# Altium schematic sheet C283x_DSP.SchDoc
size C; DocumentNumber: 3; SheetNumber: 3; SheetTotal: 9
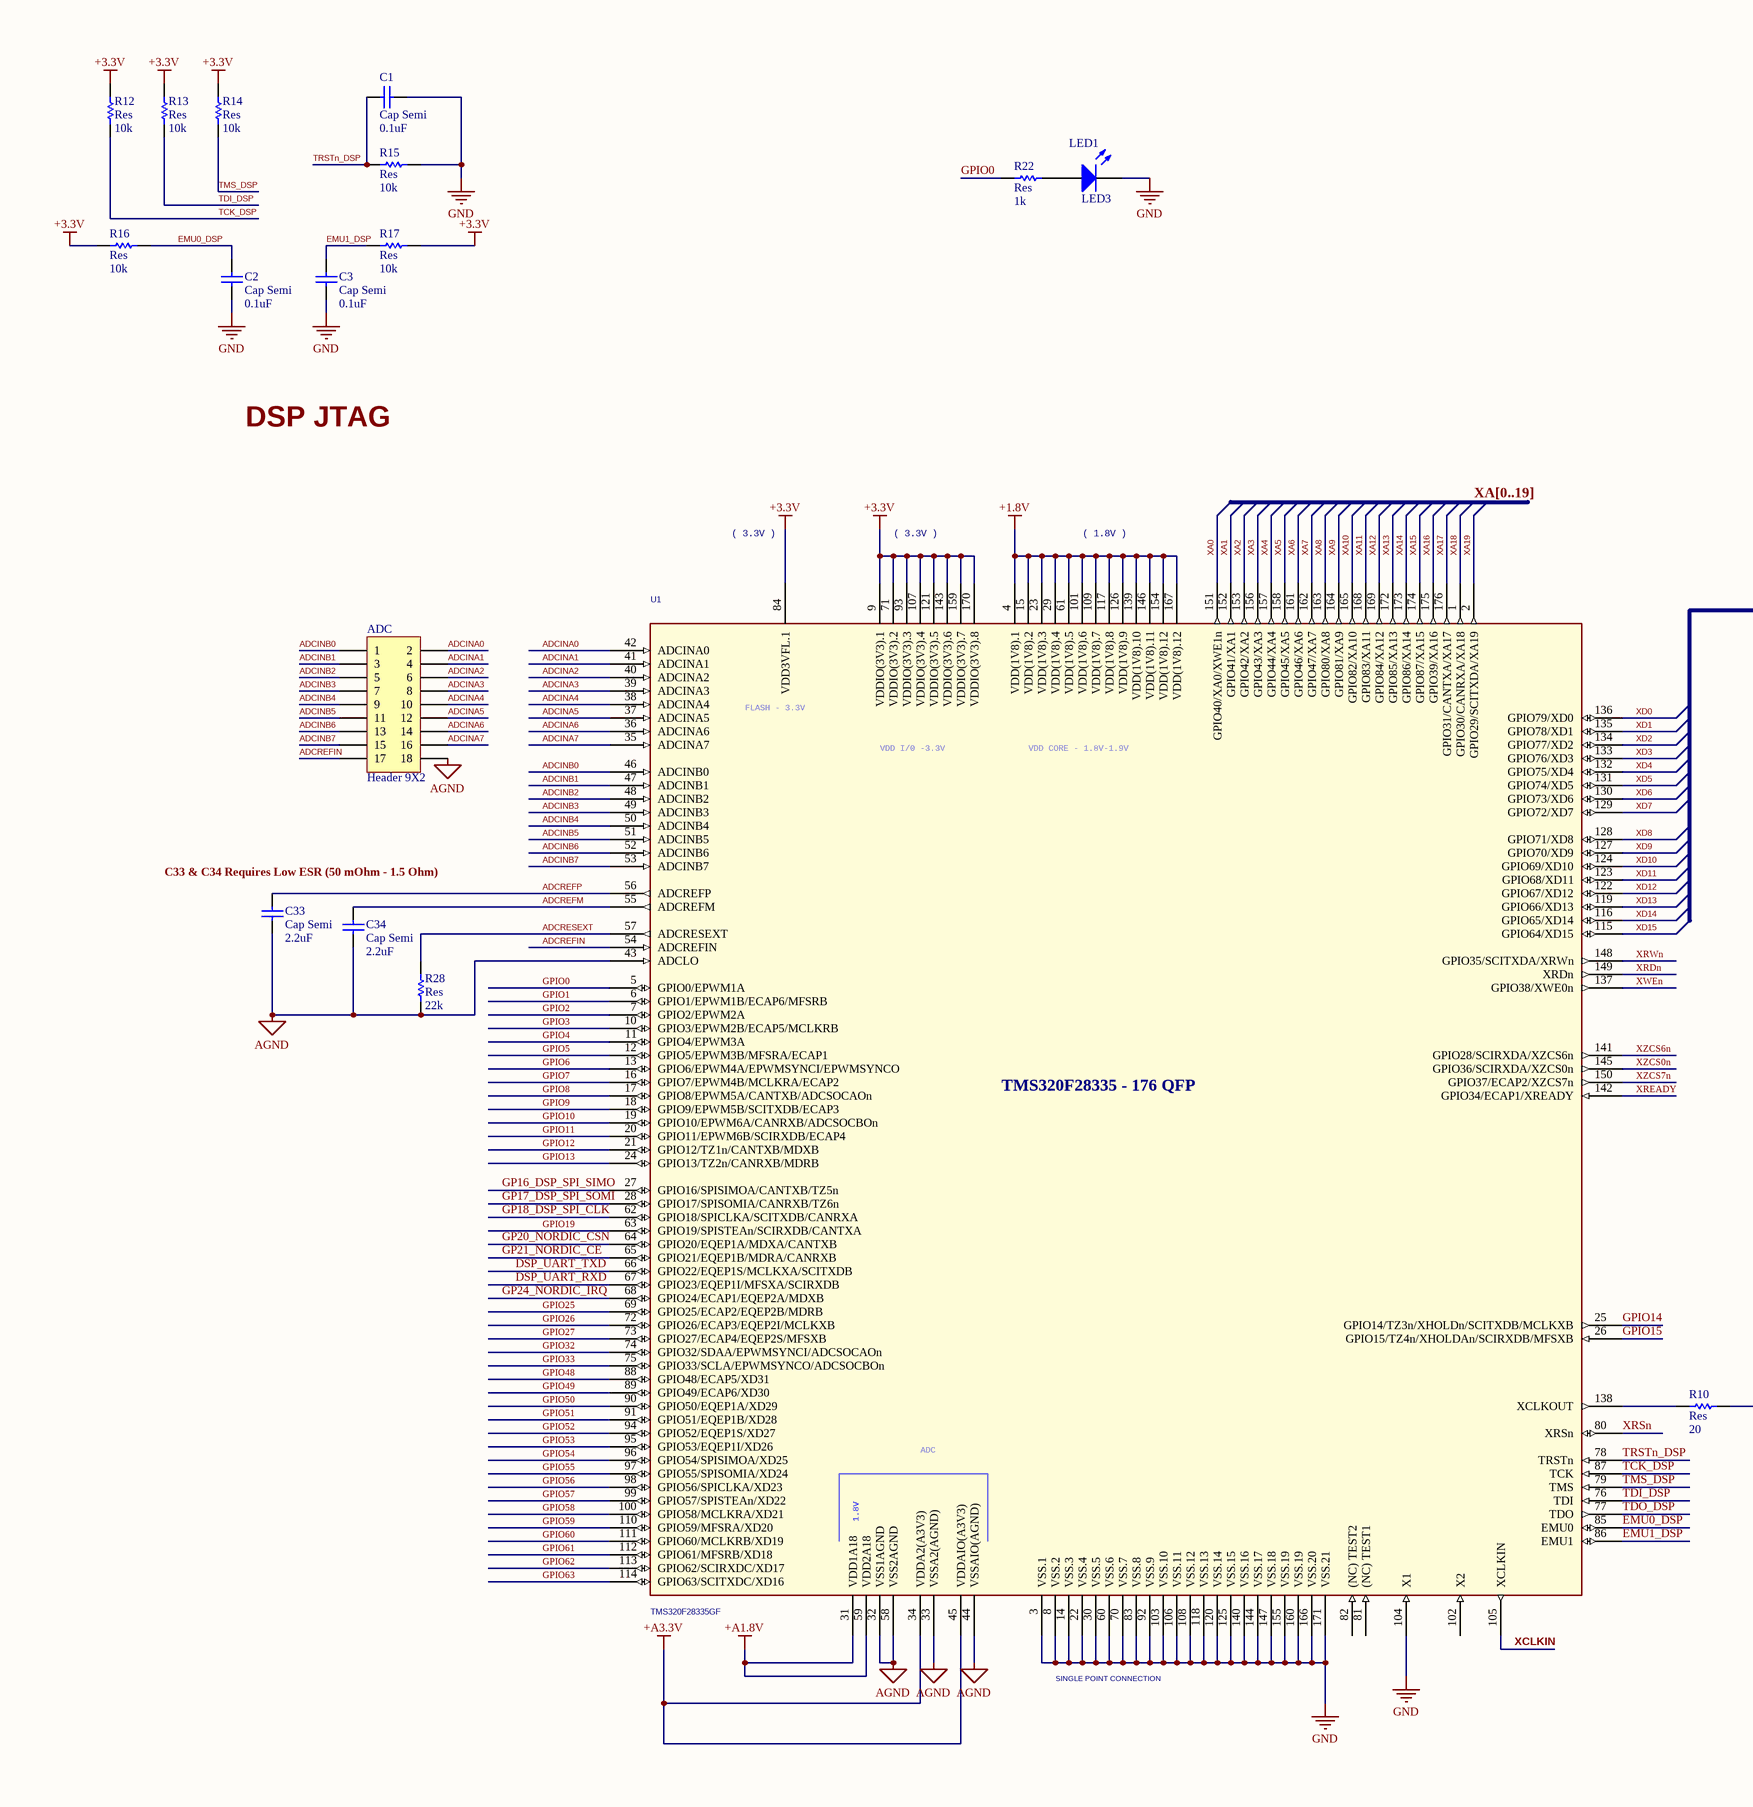
[diagram p0: C283x_DSP.SchDoc, left]
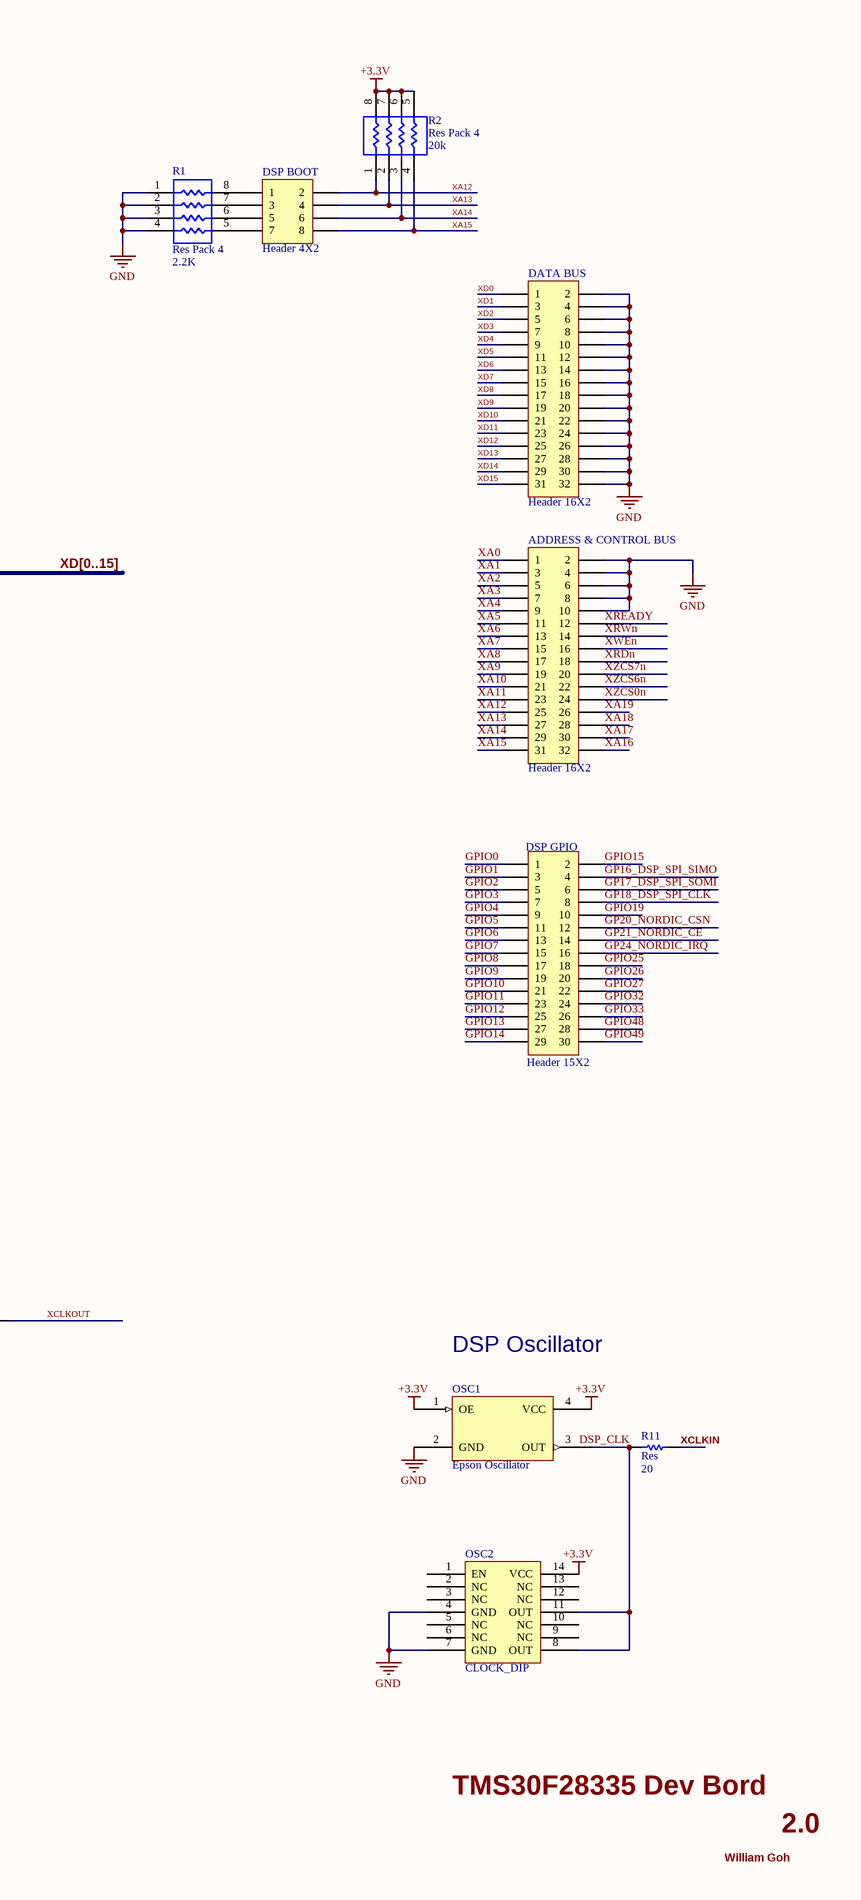
[diagram p1: C283x_DSP.SchDoc, right]

## Parts
ADC  Header 9X2  [HDR2X9]
ADDRESS_&_CONTROL_BUS  Header 16X2  [HDR2X16]
C1  Cap Semi  value 0.1uF  [0805]
C2  Cap Semi  value 0.1uF  [0805]
C3  Cap Semi  value 0.1uF  [0805]
C33  Cap Semi  value 2.2uF  [0805]
C34  Cap Semi  value 2.2uF  [0805]
DATA_BUS  Header 16X2  [HDR2X16]
DSP_BOOT  Header 4X2  [HDR2X4]
DSP_GPIO  Header 15X2  [HDR2X15]
LED1  LED3  [0805]
OSC1  Epson Oscillator  [Oscillator]
OSC2  CLOCK_DIP  [DIP-14]
R1  Res Pack 4  value 2.2K  [SO-8]
R2  Res Pack 4  value 20k  [SO-8]
R10  Res  value 20  [0805]
R11  Res  value 20  [0805]
R12  Res  value 10k  [0805]
R13  Res  value 10k  [0805]
R14  Res  value 10k  [0805]
R15  Res  value 10k  [0805]
R16  Res  value 10k  [0805]
R17  Res  value 10k  [0805]
R22  Res  value 1k  [0805]
R28  Res  value 22k  [0805]
U1  TMS320F28335GF  [QFP176]

## Nets
+1.8V: U1.4(VDD(1V8).1) U1.15(VDD(1V8).2) U1.23(VDD(1V8).3) U1.29(VDD(1V8).4) U1.61(VDD(1V8).5) U1.101(VDD(1V8).6) U1.109(VDD(1V8).7) U1.117(VDD(1V8).8) U1.126(VDD(1V8).9) U1.139(VDD(1V8).10) U1.146(VDD(1V8).11) U1.154(VDD(1V8).12) U1.167(VDD(1V8).12)
+3.3V: OSC1.1(OE) OSC1.4(VCC) OSC2.14(VCC) R2.5 R2.6 R2.7 R2.8 R12.2 R13.2 R14.2 R16.1 R17.2 U1.9(VDDIO(3V3).1) U1.71(VDDIO(3V3).2) U1.84(VDD3VFL.1) U1.93(VDDIO(3V3).3) U1.107(VDDIO(3V3).4) U1.121(VDDIO(3V3).5) U1.143(VDDIO(3V3).6) U1.159(VDDIO(3V3).7) U1.170(VDDIO(3V3).8)
+A1.8V: U1.31(VDD1A18) U1.59(VDD2A18)
+A3.3V: U1.34(VDDA2(A3V3)) U1.45(VDDAIO(A3V3))
AGND: ADC.18 C33.2 C34.2 R28.1 U1.32(VSS1AGND) U1.33(VSSA2(AGND)) U1.43(ADCLO) U1.44(VSSAIO(AGND)) U1.58(VSS2AGND)
GND: ADDRESS_&_CONTROL_BUS.2 ADDRESS_&_CONTROL_BUS.4 ADDRESS_&_CONTROL_BUS.6 ADDRESS_&_CONTROL_BUS.8 ADDRESS_&_CONTROL_BUS.10 C1.1 C2.1 C3.1 DATA_BUS.2 DATA_BUS.4 DATA_BUS.6 DATA_BUS.8 DATA_BUS.10 DATA_BUS.12 DATA_BUS.14 DATA_BUS.16 DATA_BUS.18 DATA_BUS.20 DATA_BUS.22 DATA_BUS.24 DATA_BUS.26 DATA_BUS.28 DATA_BUS.30 DATA_BUS.32 LED1.2(K) OSC1.2(GND) OSC2.4(GND) OSC2.7(GND) R1.1 R1.2 R1.3 R1.4 R15.2 U1.3(VSS.1) U1.8(VSS.2) U1.14(VSS.3) U1.22(VSS.4) U1.30(VSS.5) U1.60(VSS.6) U1.70(VSS.7) U1.83(VSS.8) U1.92(VSS.9) U1.103(VSS.10) U1.104(X1) U1.106(VSS.11) U1.108(VSS.12) U1.118(VSS.13) U1.120(VSS.14) U1.125(VSS.15) U1.140(VSS.16) U1.144(VSS.17) U1.147(VSS.18) U1.155(VSS.19) U1.160(VSS.19) U1.166(VSS.20) U1.171(VSS.21)
ADCINA0: ADC.2 U1.42(ADCINA0)
ADCINA1: ADC.4 U1.41(ADCINA1)
ADCINA2: ADC.6 U1.40(ADCINA2)
ADCINA3: ADC.8 U1.39(ADCINA3)
ADCINA4: ADC.10 U1.38(ADCINA4)
ADCINA5: ADC.12 U1.37(ADCINA5)
ADCINA6: ADC.14 U1.36(ADCINA6)
ADCINA7: ADC.16 U1.35(ADCINA7)
ADCINB0: ADC.1 U1.46(ADCINB0)
ADCINB1: ADC.3 U1.47(ADCINB1)
ADCINB2: ADC.5 U1.48(ADCINB2)
ADCINB3: ADC.7 U1.49(ADCINB3)
ADCINB4: ADC.9 U1.50(ADCINB4)
ADCINB5: ADC.11 U1.51(ADCINB5)
ADCINB6: ADC.13 U1.52(ADCINB6)
ADCINB7: ADC.15 U1.53(ADCINB7)
ADCREFIN: ADC.17 U1.54(ADCREFIN)
ADCREFM: C34.1 U1.55(ADCREFM)
ADCREFP: C33.1 U1.56(ADCREFP)
ADCRESEXT: R28.2 U1.57(ADCRESEXT)
DSP_UART_RXD: U1.67(GPIO23/EQEP1I/MFSXA/SCIRXDB)
DSP_UART_TXD: U1.66(GPIO22/EQEP1S/MCLKXA/SCITXDB)
EMU0_DSP: C2.2 R16.2 U1.85(EMU0)
EMU1_DSP: C3.2 R17.1 U1.86(EMU1)
GP16_DSP_SPI_SIMO: DSP_GPIO.4 U1.27(GPIO16/SPISIMOA/CANTXB/TZ5n)
GP17_DSP_SPI_SOMI: DSP_GPIO.6 U1.28(GPIO17/SPISOMIA/CANRXB/TZ6n)
GP18_DSP_SPI_CLK: DSP_GPIO.8 U1.62(GPIO18/SPICLKA/SCITXDB/CANRXA)
GP20_NORDIC_CSN: DSP_GPIO.12 U1.64(GPIO20/EQEP1A/MDXA/CANTXB)
GP21_NORDIC_CE: DSP_GPIO.14 U1.65(GPIO21/EQEP1B/MDRA/CANRXB)
GP24_NORDIC_IRQ: DSP_GPIO.16 U1.68(GPIO24/ECAP1/EQEP2A/MDXB)
GPIO0: DSP_GPIO.1 R22.1 U1.5(GPIO0/EPWM1A)
GPIO1: DSP_GPIO.3 U1.6(GPIO1/EPWM1B/ECAP6/MFSRB)
GPIO2: DSP_GPIO.5 U1.7(GPIO2/EPWM2A)
GPIO3: DSP_GPIO.7 U1.10(GPIO3/EPWM2B/ECAP5/MCLKRB)
GPIO4: DSP_GPIO.9 U1.11(GPIO4/EPWM3A)
GPIO5: DSP_GPIO.11 U1.12(GPIO5/EPWM3B/MFSRA/ECAP1)
GPIO6: DSP_GPIO.13 U1.13(GPIO6/EPWM4A/EPWMSYNCI/EPWMSYNCO)
GPIO7: DSP_GPIO.15 U1.16(GPIO7/EPWM4B/MCLKRA/ECAP2)
GPIO8: DSP_GPIO.17 U1.17(GPIO8/EPWM5A/CANTXB/ADCSOCAOn)
GPIO9: DSP_GPIO.19 U1.18(GPIO9/EPWM5B/SCITXDB/ECAP3)
GPIO10: DSP_GPIO.21 U1.19(GPIO10/EPWM6A/CANRXB/ADCSOCBOn)
GPIO11: DSP_GPIO.23 U1.20(GPIO11/EPWM6B/SCIRXDB/ECAP4)
GPIO12: DSP_GPIO.25 U1.21(GPIO12/TZ1n/CANTXB/MDXB)
GPIO13: DSP_GPIO.27 U1.24(GPIO13/TZ2n/CANRXB/MDRB)
GPIO14: DSP_GPIO.29 U1.25(GPIO14/TZ3n/XHOLDn/SCITXDB/MCLKXB)
GPIO15: DSP_GPIO.2 U1.26(GPIO15/TZ4n/XHOLDAn/SCIRXDB/MFSXB)
GPIO19: DSP_GPIO.10 U1.63(GPIO19/SPISTEAn/SCIRXDB/CANTXA)
GPIO25: DSP_GPIO.18 U1.69(GPIO25/ECAP2/EQEP2B/MDRB)
GPIO26: DSP_GPIO.20 U1.72(GPIO26/ECAP3/EQEP2I/MCLKXB)
GPIO27: DSP_GPIO.22 U1.73(GPIO27/ECAP4/EQEP2S/MFSXB)
GPIO32: DSP_GPIO.24 U1.74(GPIO32/SDAA/EPWMSYNCI/ADCSOCAOn)
GPIO33: DSP_GPIO.26 U1.75(GPIO33/SCLA/EPWMSYNCO/ADCSOCBOn)
GPIO48: DSP_GPIO.28 U1.88(GPIO48/ECAP5/XD31)
GPIO49: DSP_GPIO.30 U1.89(GPIO49/ECAP6/XD30)
GPIO50: U1.90(GPIO50/EQEP1A/XD29)
GPIO51: U1.91(GPIO51/EQEP1B/XD28)
GPIO52: U1.94(GPIO52/EQEP1S/XD27)
GPIO53: U1.95(GPIO53/EQEP1I/XD26)
GPIO54: U1.96(GPIO54/SPISIMOA/XD25)
GPIO55: U1.97(GPIO55/SPISOMIA/XD24)
GPIO56: U1.98(GPIO56/SPICLKA/XD23)
GPIO57: U1.99(GPIO57/SPISTEAn/XD22)
GPIO58: U1.100(GPIO58/MCLKRA/XD21)
GPIO59: U1.110(GPIO59/MFSRA/XD20)
GPIO60: U1.111(GPIO60/MCLKRB/XD19)
GPIO61: U1.112(GPIO61/MFSRB/XD18)
GPIO62: U1.113(GPIO62/SCIRXDC/XD17)
GPIO63: U1.114(GPIO63/SCITXDC/XD16)
TCK_DSP: R12.1 U1.87(TCK)
TDI_DSP: R13.1 U1.76(TDI)
TDO_DSP: U1.77(TDO)
TMS_DSP: R14.1 U1.79(TMS)
TRSTn_DSP: C1.2 R15.1 U1.78(TRSTn)
XA0: ADDRESS_&_CONTROL_BUS.1 U1.151(GPIO40/XA0/XWE1n)
XA1: ADDRESS_&_CONTROL_BUS.3 U1.152(GPIO41/XA1)
XA2: ADDRESS_&_CONTROL_BUS.5 U1.153(GPIO42/XA2)
XA3: ADDRESS_&_CONTROL_BUS.7 U1.156(GPIO43/XA3)
XA4: ADDRESS_&_CONTROL_BUS.9 U1.157(GPIO44/XA4)
XA5: ADDRESS_&_CONTROL_BUS.11 U1.158(GPIO45/XA5)
XA6: ADDRESS_&_CONTROL_BUS.13 U1.161(GPIO46/XA6)
XA7: ADDRESS_&_CONTROL_BUS.15 U1.162(GPIO47/XA7)
XA8: ADDRESS_&_CONTROL_BUS.17 U1.163(GPIO80/XA8)
XA9: ADDRESS_&_CONTROL_BUS.19 U1.164(GPIO81/XA9)
XA10: ADDRESS_&_CONTROL_BUS.21 U1.165(GPIO82/XA10)
XA11: ADDRESS_&_CONTROL_BUS.23 U1.168(GPIO83/XA11)
XA12: ADDRESS_&_CONTROL_BUS.25 DSP_BOOT.2 R2.1 U1.169(GPIO84/XA12)
XA13: ADDRESS_&_CONTROL_BUS.27 DSP_BOOT.4 R2.2 U1.172(GPIO85/XA13)
XA14: ADDRESS_&_CONTROL_BUS.29 DSP_BOOT.6 R2.3 U1.173(GPIO86/XA14)
XA15: ADDRESS_&_CONTROL_BUS.31 DSP_BOOT.8 R2.4 U1.174(GPIO87/XA15)
XA16: ADDRESS_&_CONTROL_BUS.32 U1.175(GPIO39/XA16)
XA17: ADDRESS_&_CONTROL_BUS.30 U1.176(GPIO31/CANTXA/XA17)
XA18: ADDRESS_&_CONTROL_BUS.28 U1.1(GPIO30/CANRXA/XA18)
XA19: ADDRESS_&_CONTROL_BUS.26 U1.2(GPIO29/SCITXDA/XA19)
XCLKIN: R11.2 U1.105(XCLKIN)
XCLKOUT: R10.2
XD0: DATA_BUS.1 U1.136(GPIO79/XD0)
XD1: DATA_BUS.3 U1.135(GPIO78/XD1)
XD2: DATA_BUS.5 U1.134(GPIO77/XD2)
XD3: DATA_BUS.7 U1.133(GPIO76/XD3)
XD4: DATA_BUS.9 U1.132(GPIO75/XD4)
XD5: DATA_BUS.11 U1.131(GPIO74/XD5)
XD6: DATA_BUS.13 U1.130(GPIO73/XD6)
XD7: DATA_BUS.15 U1.129(GPIO72/XD7)
XD8: DATA_BUS.17 U1.128(GPIO71/XD8)
XD9: DATA_BUS.19 U1.127(GPIO70/XD9)
XD10: DATA_BUS.21 U1.124(GPIO69/XD10)
XD11: DATA_BUS.23 U1.123(GPIO68/XD11)
XD12: DATA_BUS.25 U1.122(GPIO67/XD12)
XD13: DATA_BUS.27 U1.119(GPIO66/XD13)
XD14: DATA_BUS.29 U1.116(GPIO65/XD14)
XD15: DATA_BUS.31 U1.115(GPIO64/XD15)
XRDn: ADDRESS_&_CONTROL_BUS.18 U1.149(XRDn)
XREADY: ADDRESS_&_CONTROL_BUS.12 U1.142(GPIO34/ECAP1/XREADY)
XRSn: U1.80(XRSn)
XRWn: ADDRESS_&_CONTROL_BUS.14 U1.148(GPIO35/SCITXDA/XRWn)
XWEn: ADDRESS_&_CONTROL_BUS.16 U1.137(GPIO38/XWE0n)
XZCS0n: ADDRESS_&_CONTROL_BUS.24 U1.145(GPIO36/SCIRXDA/XZCS0n)
XZCS6n: ADDRESS_&_CONTROL_BUS.22 U1.141(GPIO28/SCIRXDA/XZCS6n)
XZCS7n: ADDRESS_&_CONTROL_BUS.20 U1.150(GPIO37/ECAP2/XZCS7n)
NetDSP_BOOT_1: DSP_BOOT.1 R1.8
NetDSP_BOOT_3: DSP_BOOT.3 R1.7
NetDSP_BOOT_5: DSP_BOOT.5 R1.6
NetDSP_BOOT_7: DSP_BOOT.7 R1.5
NetLED1_1: LED1.1(A) R22.2
NetOSC1_3: OSC1.3(OUT) OSC2.8(OUT) OSC2.11(OUT) R11.1
NetR10_1: R10.1 U1.138(XCLKOUT)

Not connected (* = marked no-connect by the designer): OSC2 1(EN) 2(NC) 3(NC) 5(NC) 6(NC) 9(NC) 10(NC) 12(NC) 13(NC); U1 81((NC)_TEST1) 82((NC)_TEST2) 102(X2)

## Buses and harness runs
bus XA[0..19]
bus XD[0..15]

## Notes on the sheet
- DSP JTAG
- ( 3.3V )
- ( 1.8V )
- C33 & C34 Requires Low ESR (50 mOhm - 1.5 Ohm)
- DSP Oscillator
- SINGLE POINT CONNECTION
- TMS30F28335 Dev Bord
- William Goh
- 2.0
- Labels drawn without touching a wire or pin: DSP_CLK
- (in symbol TMS320F283XXPGF_23) FLASH - 3.3V; VDD I/0 -3.3V; VDD CORE - 1.8V-1.9V; TMS320F28335 - 176 QFP; ADC; 1.8V

## Library data of the parts
ADC = Header 9X2: Header, 9-Pin, Dual row; LatestRevisionDate: 17-Jul-2002; LatestRevisionNote: Re-released for DXP Platform.; Publisher: Altium Limited
ADDRESS_&_CONTROL_BUS DATA_BUS = Header 16X2: Header, 16-Pin, Dual row; LatestRevisionDate: 17-Jul-2002; LatestRevisionNote: Re-released for DXP Platform.; Publisher: Altium Limited
C1-C3 C33 C34 = Cap Semi: Capacitor (Semiconductor SIM Model); Published: 8-Jun-2000; LatestRevisionDate: 17-Jul-2002; LatestRevisionNote: Re-released for DXP Platform.; PackageReference: C1206; Publisher: Altium Limited
DSP_BOOT = Header 4X2: Header, 4-Pin, Dual row; LatestRevisionDate: 17-Jul-2002; LatestRevisionNote: Re-released for DXP Platform.; Publisher: Altium Limited
DSP_GPIO = Header 15X2: Header, 15-Pin, Dual row; LatestRevisionDate: 17-Jul-2002; LatestRevisionNote: Re-released for DXP Platform.; Publisher: Altium Limited
LED1 = LED3: Typical BLUE SiC LED; Published: 8-Jun-2000; LatestRevisionDate: 17-Dec-2003; LatestRevisionNote: PCB Footprint replaced.; DatasheetDocument: 16-Apr-2002; PackageDocument: 16-Apr-2002; PackageReference: 3.5X2.8X1.9; Publisher: Altium Limited
OSC1 = Oscillator: 15Mhz Epson Clock; Digikey #: SE2826CT-ND
R1 R2 = Res Pack 4: 4 Isolated Resistor Network; Published: 24-Mar-1999; LatestRevisionDate: 17-Jul-2002; LatestRevisionNote: Re-released for DXP Platform.; PackageReference: SO-16; Publisher: Altium Limited
  R1: Digikey #: YC164J-2.2KCT-ND
  R2: Digikey #: YC164J-20KCT-ND
R10-R17 R22 R28 = Res Semi: Semiconductor Resistor; Published: 8-Jun-2000; LatestRevisionDate: 17-Jul-2002; LatestRevisionNote: Re-released for DXP Platform.; PackageReference: AXIAL-0.5; Publisher: Altium Limited
U1 = TMS320F283XXPGF_23: Texas Instruments F28335; Digikey #: 296-23660-ND